# Altium schematic sheet KMP-Watermeter-Schematic.SchDoc
size A; SheetNumber: 1
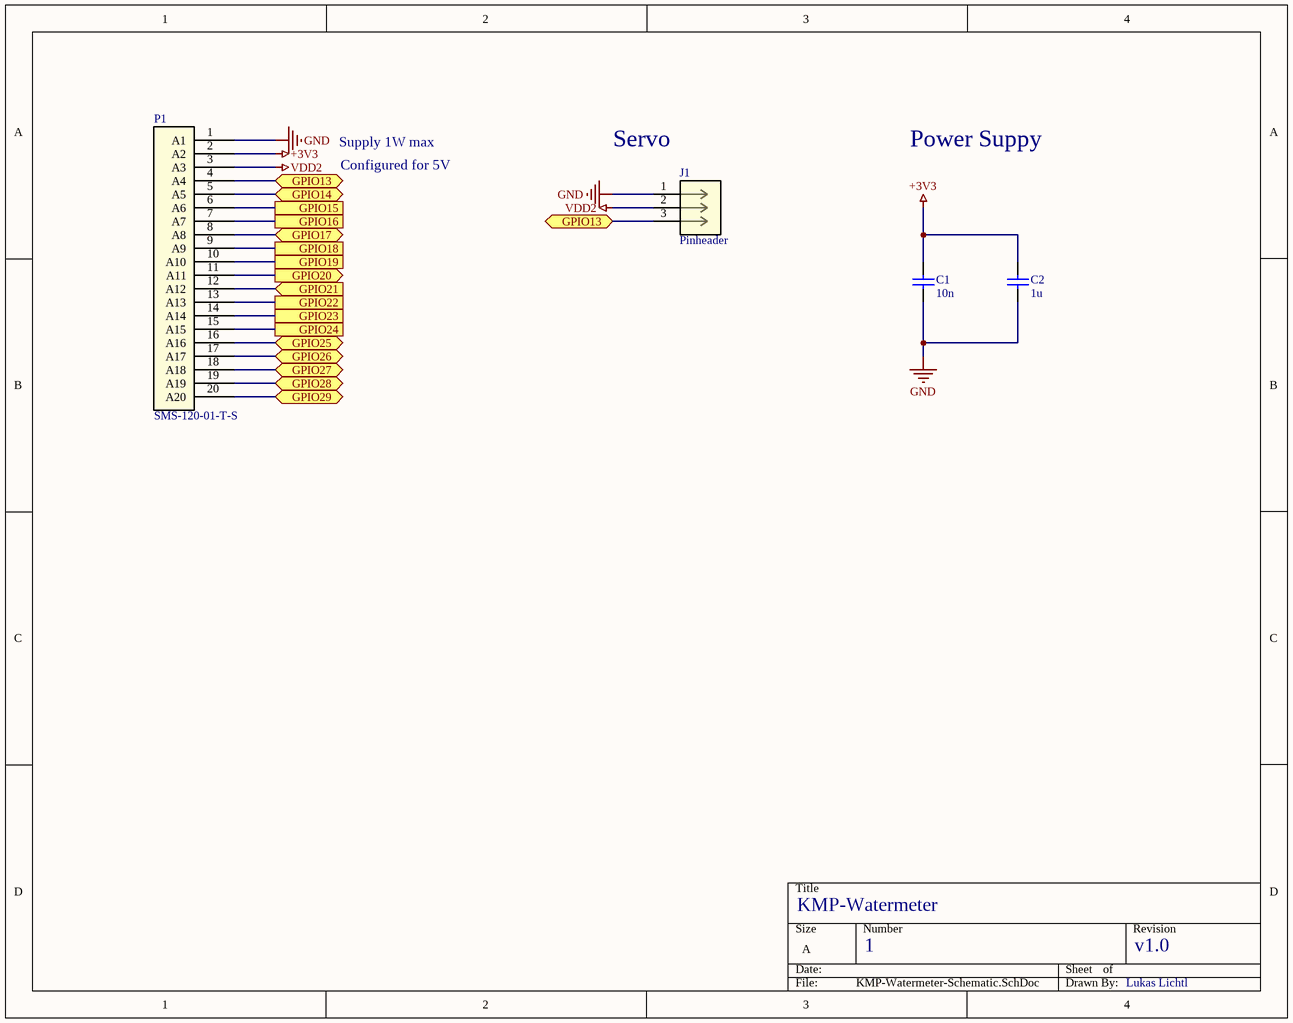
[diagram p0: KMP-Watermeter-Schematic.SchDoc]

## Parts
C1  10n  [CAPC1608X90X35LL15T15]
C2  1u  [CAPC1608X90X35LL15T15]
J1  Pinheader  [CONN03_6130_7P62X2P54_WRE]
P1  SMS-120-01-T-S  [SMS-S-120]

## Ports
GPIO13 (bidir), GPIO14 (bidir), GPIO15, GPIO16, GPIO17 (bidir), GPIO18, GPIO19, GPIO20 (out), GPIO21 (in), GPIO22, GPIO23, GPIO24, GPIO25 (bidir), GPIO26 (bidir), GPIO27 (bidir), GPIO28 (bidir), GPIO29 (bidir)

## Nets
+3V3: C1.2 C2.2 P1.2(A2)
GND: C1.1 C2.1 J1.1 P1.1(A1)
VDD2: J1.2 P1.3(A3)
GPIO13: J1.3 P1.4(A4) ; port GPIO13
GPIO14: P1.5(A5) ; port GPIO14
GPIO15: P1.6(A6) ; port GPIO15
GPIO16: P1.7(A7) ; port GPIO16
GPIO17: P1.8(A8) ; port GPIO17
GPIO18: P1.9(A9) ; port GPIO18
GPIO19: P1.10(A10) ; port GPIO19
GPIO20: P1.11(A11) ; port GPIO20
GPIO21: P1.12(A12) ; port GPIO21
GPIO22: P1.13(A13) ; port GPIO22
GPIO23: P1.14(A14) ; port GPIO23
GPIO24: P1.15(A15) ; port GPIO24
GPIO25: P1.16(A16) ; port GPIO25
GPIO26: P1.17(A17) ; port GPIO26
GPIO27: P1.18(A18) ; port GPIO27
GPIO28: P1.19(A19) ; port GPIO28
GPIO29: P1.20(A20) ; port GPIO29

## Notes on the sheet
- Supply 1W max
- (near J1) Servo
- Power Suppy
- Configured for 5V
- KMP-Watermeter
- 1
- v1.0
- Lukas Lichtl

## Library data of the parts
C1 C2 = CMP-2006-02133-1: Manufacturer: AVX Interconnect / Elco; Part Number: 0603ZC101KAT2A
J1 = 61300311121: WR-PHD 2.54 mm Pin Header; Manufacturer_Name: Wurth Electronics; Copyright: Copyright (C) 2026 Ultra Librarian. All rights reserved.; Manufacturer_Part_Number: 61300311121; RefDes: RefDes; Type: Type
P1 = SMS-120-01-T-S: No Description Available; Mfr_Name: Samtec Inc; RefDes: RefDes; Type: Type